# EAGLE schematic 1.8V Regler (EAGLE 7.1.0)
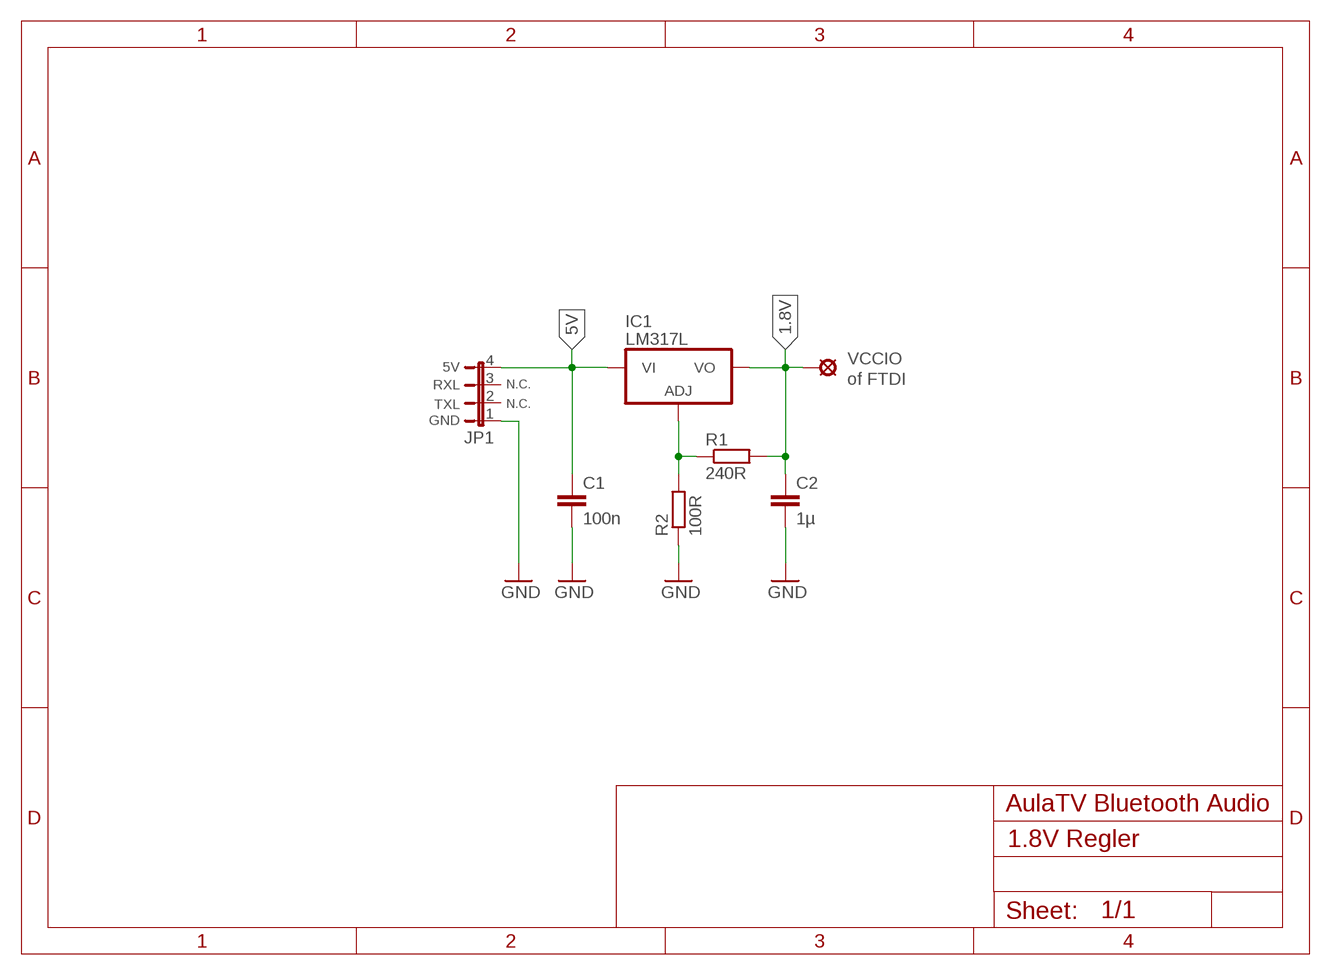
[diagram p0: schematic, sheet 1]

## Parts
C1  100n  C-EUC0805  [C0805]
C2  1µ  C-EUC0805  [C0805]
IC1  LM317L  [TO92TAPE]
JP1  JP4E  [JP4]
R1  240R  R-EU_R0805  [R0805]
R2  100R  R-EU_R0805  [R0805]
VCCIO  VCCIO  LSP10  [LSP10]

## Nets
1.8V: C2.1 IC1.P$3(VO) R1.2 VCCIO.MP
5V: C1.1 IC1.P$2(VI) JP1.4
GND: C1.2 C2.2 JP1.1 R2.1
N$1: IC1.P$1(ADJ) R1.1 R2.2
Unconnected: JP1.2 JP1.3

## Notes on the sheet
- 5V
- RXL
- N.C. | of FTDI
- TXL
- N.C.
- GND
- AulaTV Bluetooth Audio

## Library data of the parts
C1 C2 = rcl:C-EU: CAPACITOR, European symbol
IC1 = linear:LM317L
JP1 = jumper:JP4E: JUMPER
R1 R2 = rcl:R-EU_: RESISTOR, European symbol
VCCIO = solpad:LSP10: SOLDER PAD drill 1.0 mm, distributor Buerklin, 12H555